# Altium schematic sheet communication.SchDoc
size A4; SheetNumber: 2; SheetTotal: 2
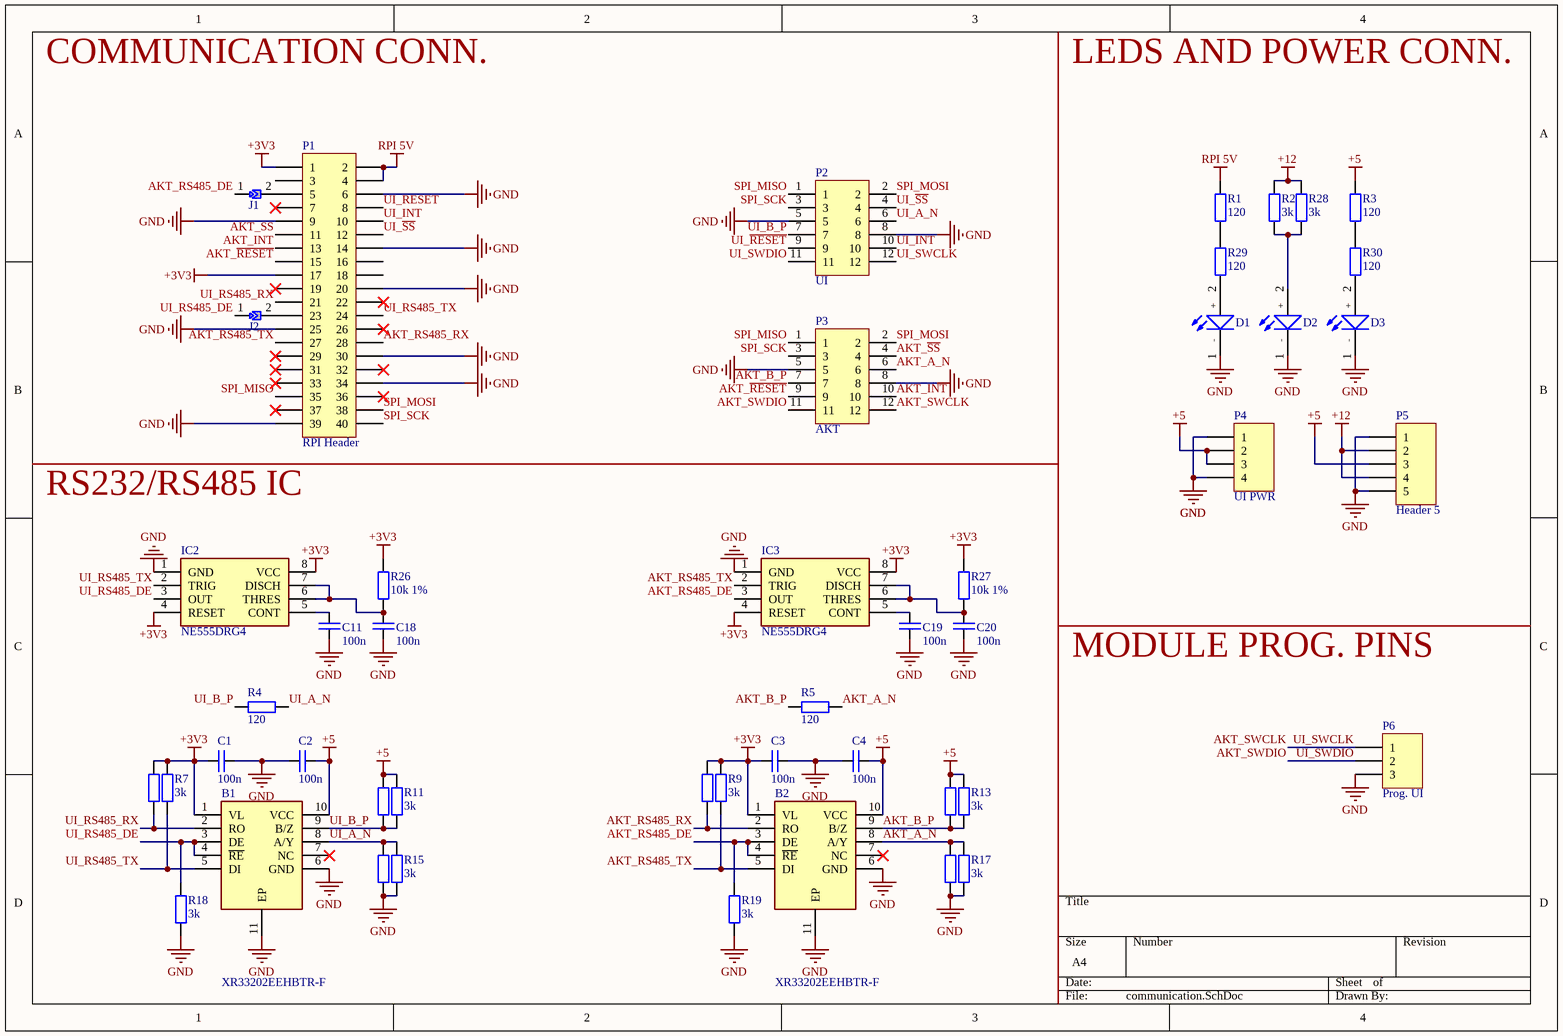
[diagram p0: communication.SchDoc]

## Parts
B1  XR33202EEHBTR-F  [SON50P300X300X80-11N-D]
B2  XR33202EEHBTR-F  [SON50P300X300X80-11N-D]
C1  100n  [R1005_0402i_L]
C2  100n  [R1005_0402i_L]
C3  100n  [R1005_0402i_L]
C4  100n  [R1005_0402i_L]
C11  100n  [R1005_0402i_L]
C18  100n  [R1005_0402i_L]
C19  100n  [R1005_0402i_L]
C20  100n  [R1005_0402i_L]
D1  LED  [LED1608_0603I_L]  (value not drawn)
D2  LED  [LED1608_0603I_L]  (value not drawn)
D3  LED  [LED1608_0603I_L]  (value not drawn)
IC2  NE555DRG4  [SOIC127P600X175-8N]
IC3  NE555DRG4  [SOIC127P600X175-8N]
J1  solder_jumper  [solder_jumper_triangle]  (value not drawn)
J2  solder_jumper  [solder_jumper_triangle]  (value not drawn)
P1  RPI Header  [HDR2X20]
P2  UI  [1.27mm SMD conn]
P3  AKT  [1.27mm SMD conn]
P4  UI PWR  [HDR1X4]
P5  Header 5  [HDR1X5]
P6  Prog. UI  [HDR1X3]
R1  120  [R1005_0402i_L]
R2  3k  [R1005_0402i_L]
R3  120  [R1005_0402i_L]
R4  120  [R1005_0402i_L]
R5  120  [R1005_0402i_L]
R6  3k  [R1005_0402i_L]  (value not drawn)
R7  3k  [R1005_0402i_L]
R8  3k  [R1005_0402i_L]  (value not drawn)
R9  3k  [R1005_0402i_L]
R10  3k  [R1005_0402i_L]  (value not drawn)
R11  3k  [R1005_0402i_L]
R12  3k  [R1005_0402i_L]  (value not drawn)
R13  3k  [R1005_0402i_L]
R14  3k  [R1005_0402i_L]  (value not drawn)
R15  3k  [R1005_0402i_L]
R16  3k  [R1005_0402i_L]  (value not drawn)
R17  3k  [R1005_0402i_L]
R18  3k  [R1005_0402i_L]
R19  3k  [R1005_0402i_L]
R26  10k 1%  [R1005_0402i_L]
R27  10k 1%  [R1005_0402i_L]
R28  3k  [R1005_0402i_L]
R29  120  [R1005_0402i_L]
R30  120  [R1005_0402i_L]

## Nets
+3V3: B1.1(VL) B2.1(VL) C1.1 C3.1 IC2.4(RESET) IC2.8(VCC) IC3.4(RESET) IC3.8(VCC) P1.1 P1.17 R6.2 R7.2 R8.2 R9.2 R26.2 R27.2
+5: B1.10(VCC) B2.10(VCC) C2.2 C4.2 P4.2 P4.3 P5.3 R3.1 R10.2 R11.2 R12.2 R13.2
+12: P5.2 P5.4 R2.1 R28.1
GND: B1.6(GND) B1.11(EP) B2.6(GND) B2.11(EP) C1.2 C2.1 C3.2 C4.1 C11.2 C18.2 C19.2 C20.2 D1.1(-) D2.1(-) D3.1(-) IC2.1(GND) IC3.1(GND) P1.6 P1.9 P1.14 P1.20 P1.25 P1.30 P1.34 P1.39 P2.5 P2.8 P3.5 P3.8 P4.1 P4.4 P5.1 P5.5 P6.3 R14.1 R15.1 R16.1 R17.1 R18.1 R19.1
RPI 5V: P1.2 P1.4 R1.1
AKT_A_N: B2.8(A/Y) P3.6 R5.2 R16.2 R17.2
AKT_B_P: B2.9(B/Z) P3.7 R5.1 R12.1 R13.1
AKT_INT: P1.13 P3.10
AKT_~{RESET}: P1.15 P3.9
AKT_RS485_DE: B2.3(DE) B2.4(~{RE}) IC3.3(OUT) J1.1 R19.2
AKT_RS485_RX: B2.2(RO) P1.28 R8.1
AKT_RS485_TX: B2.5(DI) IC3.2(TRIG) P1.27 R9.1
AKT_~{SS}: P1.11 P3.4
AKT_SWCLK: P2.12 P3.12 P6.1  [also labelled UI_SWCLK]
AKT_SWDIO: P2.11 P3.11 P6.2  [also labelled UI_SWDIO]
SPI_MISO: P1.35 P2.1 P3.1
SPI_MOSI: P1.38 P2.2 P3.2
SPI_SCK: P1.40 P2.3 P3.3
UI_A_N: B1.8(A/Y) P2.6 R4.2 R14.2 R15.2
UI_B_P: B1.9(B/Z) P2.7 R4.1 R10.1 R11.1
UI_INT: P1.10 P2.10
UI_~{RESET}: P1.8 P2.9
UI_RS485_DE: B1.3(DE) B1.4(~{RE}) IC2.3(OUT) J2.1 R18.2
UI_RS485_RX: B1.2(RO) P1.21 R6.1
UI_RS485_TX: B1.5(DI) IC2.2(TRIG) P1.24 R7.1
UI_~{SS}: P1.12 P2.4
NetC11_1: C11.1 IC2.5(CONT)
NetC18_1: C18.1 IC2.6(THRES) IC2.7(DISCH) R26.1
NetC19_1: C19.1 IC3.5(CONT)
NetC20_1: C20.1 IC3.6(THRES) IC3.7(DISCH) R27.1
NetD1_2: D1.2(+) R29.2
NetD2_2: D2.2(+) R2.2 R28.2
NetD3_2: D3.2(+) R30.2
NetJ1_2: J1.2 P1.5
NetJ2_2: J2.2 P1.23
NetR1_2: R1.2 R29.1
NetR3_2: R3.2 R30.1

Not connected (* = marked no-connect by the designer): B1 7(NC)*; B2 7(NC)*; P1 3 7* 16 18 19* 22* 26* 29* 31* 32* 33* 36* 37*

## Notes on the sheet
- COMMUNICATION CONN.
- LEDS AND POWER CONN.
- (near P1) RS232/RS485 IC
- MODULE PROG. PINS

## Library data of the parts
B1 B2 = XR33202EEHBTR-F: RS-422/RS-485 Interface IC Wide Supply Trans with I/O Interface; Manufacturer_Name: MaxLinear, Inc.; Geometry.Height: 0.8mm; Mouser Part Number: 701-XR33202EEHBTR-F; Mouser Price/Stock: https://www.mouser.co.uk/ProductDetail/MaxLinear/XR33202EEHBTR-F?qs=GtWAI9k6EVi4nRW8bj1LFw%3D%3D; Manufacturer_Part_Number: XR33202EEHBTR-F; Datasheet Link: https://www.maxlinear.com/ds/xr33202.pdf
C1-C4 C11 C18-C20 = C: Capacitor
IC2 IC3 = NE555DRG4: Integrated Circuit; Manufacturer_Name: Texas Instruments; Datasheet Link: http://www.mouser.com/ds/2/405/ne555-557499.pdf; Height: 1.75mm; Manufacturer_Part_Number: NE555DRG4; Mouser Part Number: 595-NE555DRG4; Mouser Price/Stock: https://www.mouser.co.uk/ProductDetail/Texas-Instruments/NE555DRG4?qs=rLYyFdxB%2FmreBHawQCpQ0Q%3D%3D; Arrow Part Number: NE555DRG4; Arrow Price/Stock: https://www.arrow.com/en/products/ne555drg4/texas-instruments?region=nac
P1 = Header 20X2: Header, 20-Pin, Dual row; LatestRevisionDate: 17-Jul-2002; LatestRevisionNote: Re-released for DXP Platform.; Publisher: Altium Limited
P2 P3 = 2x6 THT Header
P4 = Header 4: Header, 4-Pin; LatestRevisionDate: 17-Jul-2002; LatestRevisionNote: Re-released for DXP Platform.; Publisher: Altium Limited
P5 = Header 5: Header, 5-Pin; LatestRevisionDate: 17-Jul-2002; LatestRevisionNote: Re-released for DXP Platform.; Publisher: Altium Limited
P6 = Header 3: Header, 3-Pin; LatestRevisionDate: 17-Jul-2002; LatestRevisionNote: Re-released for DXP Platform.; Publisher: Altium Limited
R1-R19 R26-R30 = R